# EAGLE design OperantFEDv9 (EAGLE 7.7.0)
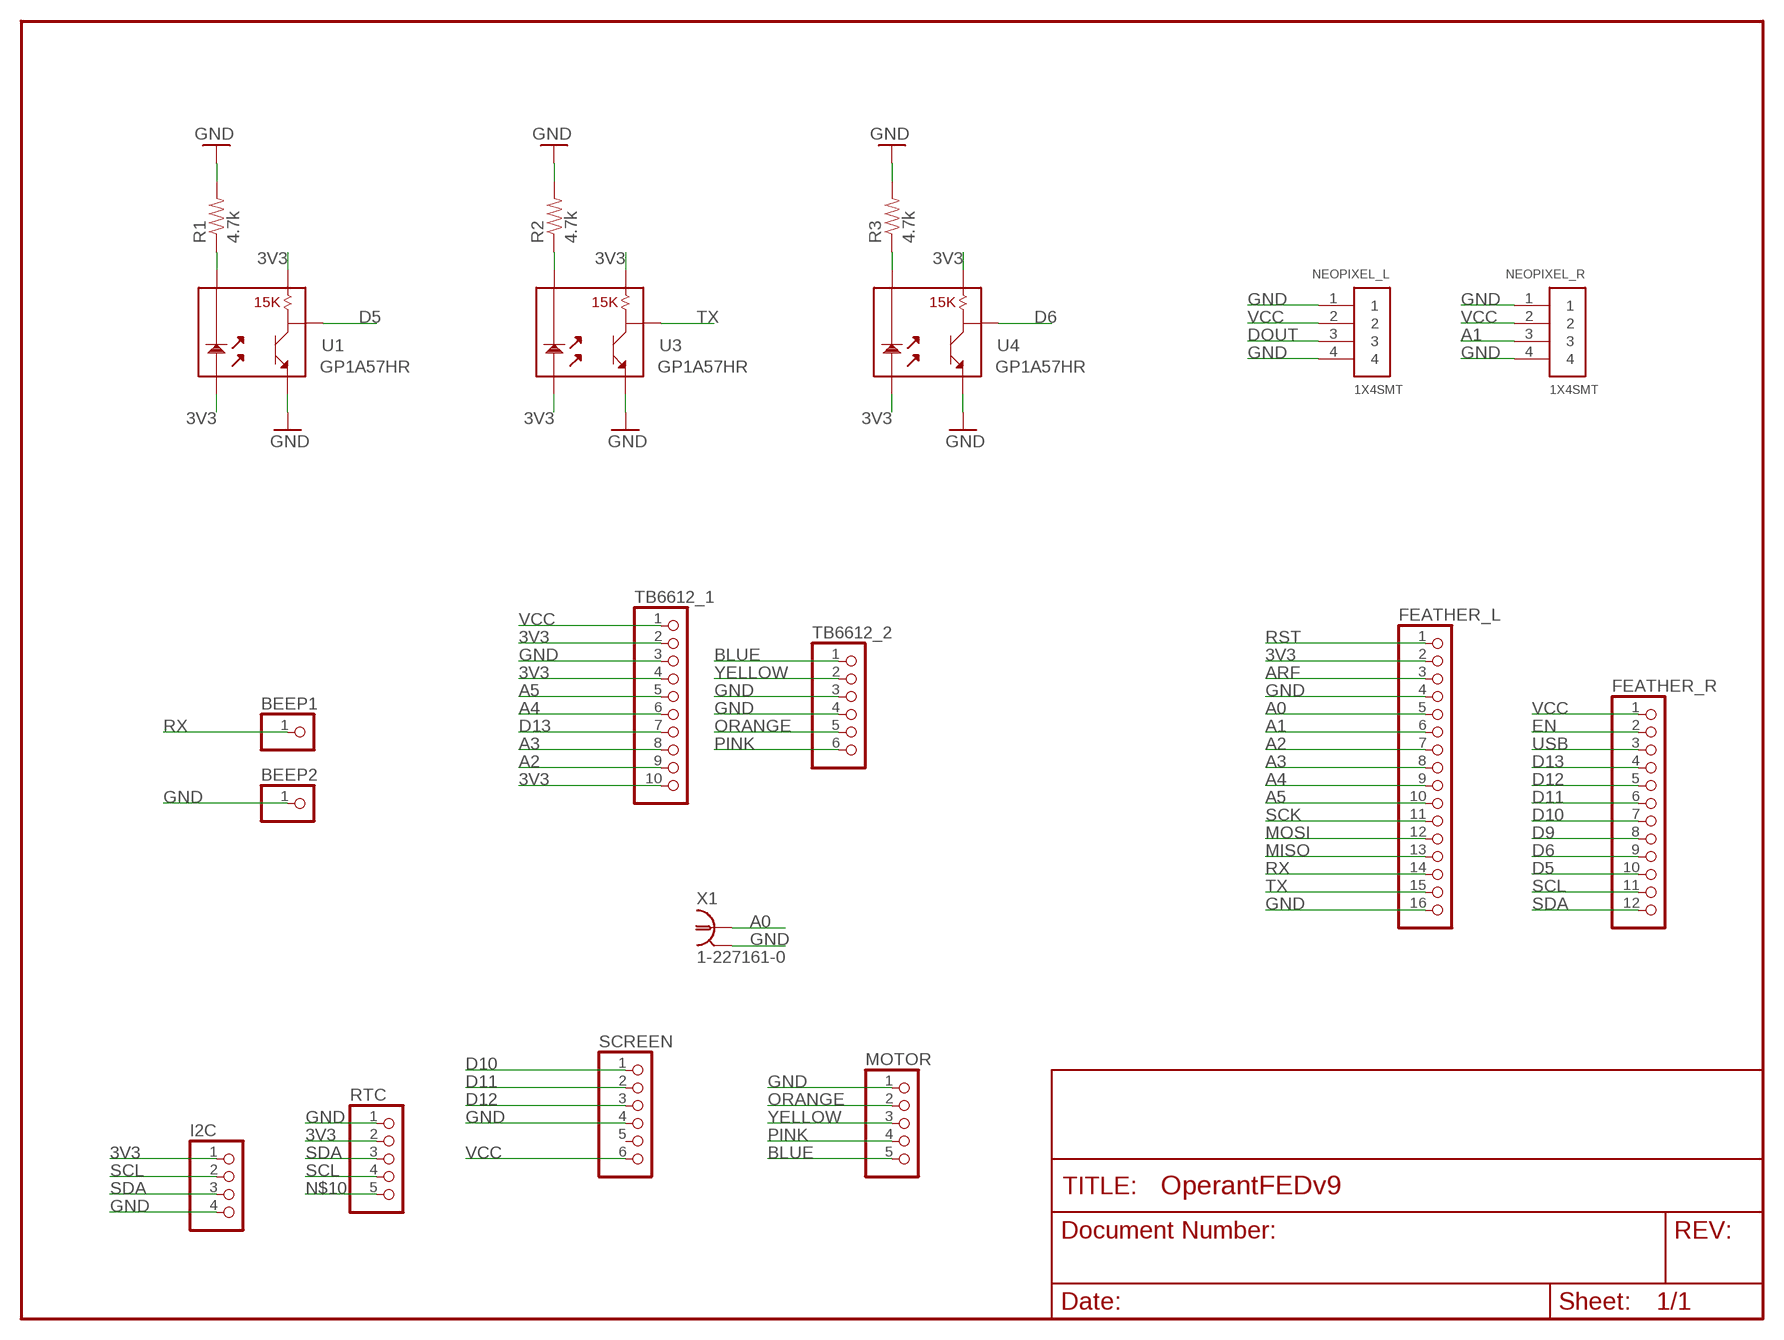
[diagram p0: schematic, sheet 1]

## Parts
BEEP1  PINHD-1X1  [1X01]
BEEP2  PINHD-1X1  [1X01]
FEATHER_L  PINHD-1X16  [1X16]
FEATHER_R  PINHD-1X12  [1X12]
I2C  PINHD-1X4  [1X04]
MOTOR  PINHD-1X5  [1X05]
NEOPIXEL_L  1X4SMT  [1X4-SMT]
NEOPIXEL_R  1X4SMT  [1X4-SMT]
R1  4.7k  RESISTORPTH1  [AXIAL-0.3]
R2  4.7k  RESISTORPTH1  [AXIAL-0.3]
R3  4.7k  RESISTORPTH1  [AXIAL-0.3]
RTC  PINHD-1X5  [1X05]
SCREEN  PINHD-1X6  [1X06]
TB6612_1  PINHD-1X10  [1X10]
TB6612_2  PINHD-1X6  [1X06]
U1  GP1A57HR  [GP1A57HR]
U3  GP1A57HR  [GP1A57HR]
U4  GP1A57HR  [GP1A57HR]
X1  1-227161-0  [AMP_227161]

## Nets
3V3: FEATHER_L.2 I2C.1 RTC.2 TB6612_1.2 TB6612_1.4 TB6612_1.10 U1.1 U1.3 U3.1 U3.3 U4.1 U4.3
A0: FEATHER_L.5 X1.1
A1: FEATHER_L.6 NEOPIXEL_R.3
A2: FEATHER_L.7 TB6612_1.9
A3: FEATHER_L.8 TB6612_1.8
A4: FEATHER_L.9 TB6612_1.6
A5: FEATHER_L.10 TB6612_1.5
ARF: FEATHER_L.3
BLUE: MOTOR.5 TB6612_2.1
D5: FEATHER_R.10 U1.4
D6: FEATHER_R.9 U4.4
D9: FEATHER_R.8
D10: FEATHER_R.7 SCREEN.1
D11: FEATHER_R.6 SCREEN.2
D12: FEATHER_R.5 SCREEN.3
D13: FEATHER_R.4 TB6612_1.7
DOUT: NEOPIXEL_L.3
EN: FEATHER_R.2
GND: BEEP2.1 FEATHER_L.4 FEATHER_L.16 I2C.4 MOTOR.1 NEOPIXEL_L.1 NEOPIXEL_L.4 NEOPIXEL_R.1 NEOPIXEL_R.4 R1.P$2 R2.P$2 R3.P$2 RTC.1 SCREEN.4 TB6612_1.3 TB6612_2.3 TB6612_2.4 U1.5 U3.5 U4.5 X1.2
MISO: FEATHER_L.13
MOSI: FEATHER_L.12
N$1: R2.P$1 U3.2
N$2: R1.P$1 U1.2
N$3: R3.P$1 U4.2
N$10: RTC.5
ORANGE: MOTOR.2 TB6612_2.5
PINK: MOTOR.4 TB6612_2.6
RST: FEATHER_L.1
RX: BEEP1.1 FEATHER_L.14
SCK: FEATHER_L.11
SCL: FEATHER_R.11 I2C.2 RTC.4
SDA: FEATHER_R.12 I2C.3 RTC.3
TX: FEATHER_L.15 U3.4
USB: FEATHER_R.3
VCC: FEATHER_R.1 NEOPIXEL_L.2 NEOPIXEL_R.2 SCREEN.6 TB6612_1.1
YELLOW: MOTOR.3 TB6612_2.2
Unconnected: SCREEN.5

## Library data of the parts
BEEP1 BEEP2 = pinhead:PINHD-1X1: PIN HEADER
FEATHER_L = pinhead:PINHD-1X16: PIN HEADER
FEATHER_R = pinhead:PINHD-1X12: PIN HEADER
I2C = pinhead:PINHD-1X4: PIN HEADER
MOTOR RTC = pinhead:PINHD-1X5: PIN HEADER
NEOPIXEL_L NEOPIXEL_R = adafruit:1X4: 4-pin connector
R1-R3 = SparkFun:RESISTOR: Resistor Basic schematic elements and footprints for 0603, 1206, and PTH 1/10th watt (small) resistors.
SCREEN TB6612_2 = pinhead:PINHD-1X6: PIN HEADER
TB6612_1 = pinhead:PINHD-1X10: PIN HEADER
U1 U3 U4 = SparkFun:GP1A57HR
X1 = con-coax:?227161*: JACK, RIGHT ANGLE, 50 OHM, PCB, BNC Source: amp_227161.pdf; MF: TYCO ELECTRONICS; MPN: 1-227161; OC_FARNELL: unknown; OC_NEWARK: 33B3200

## Board
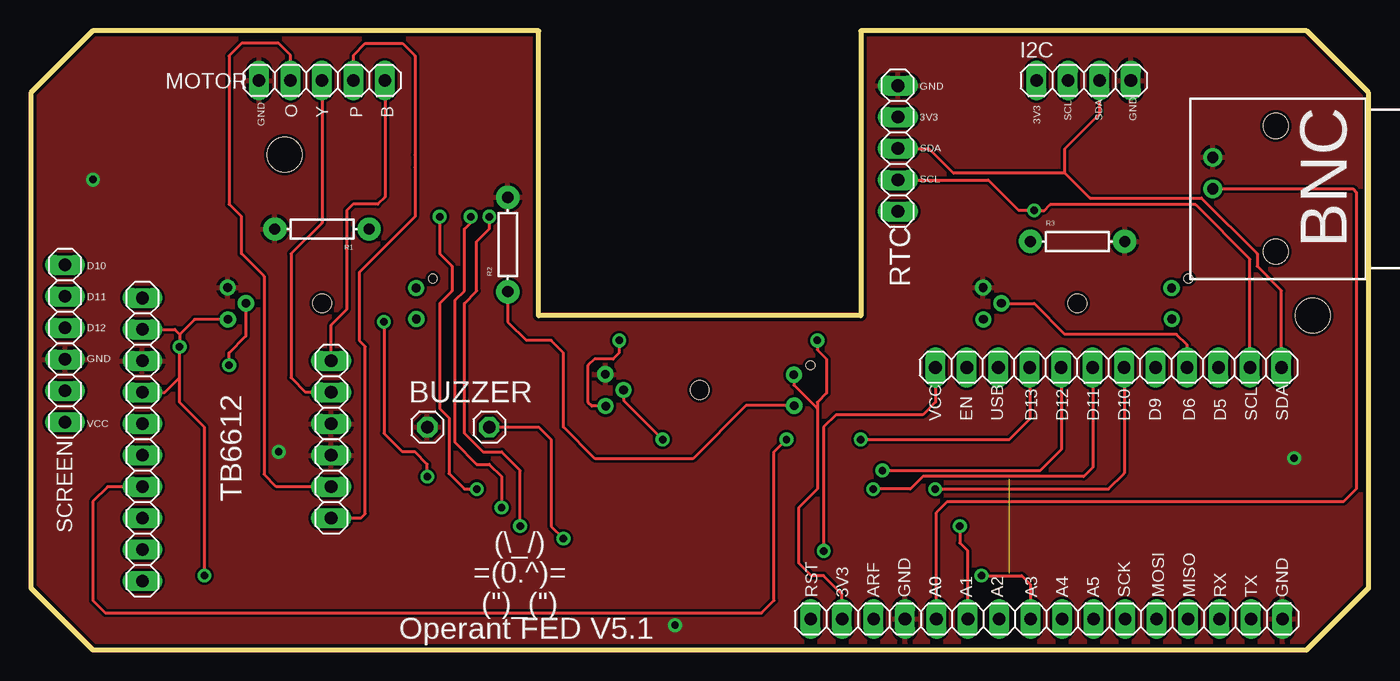
[diagram p1: board, top side]
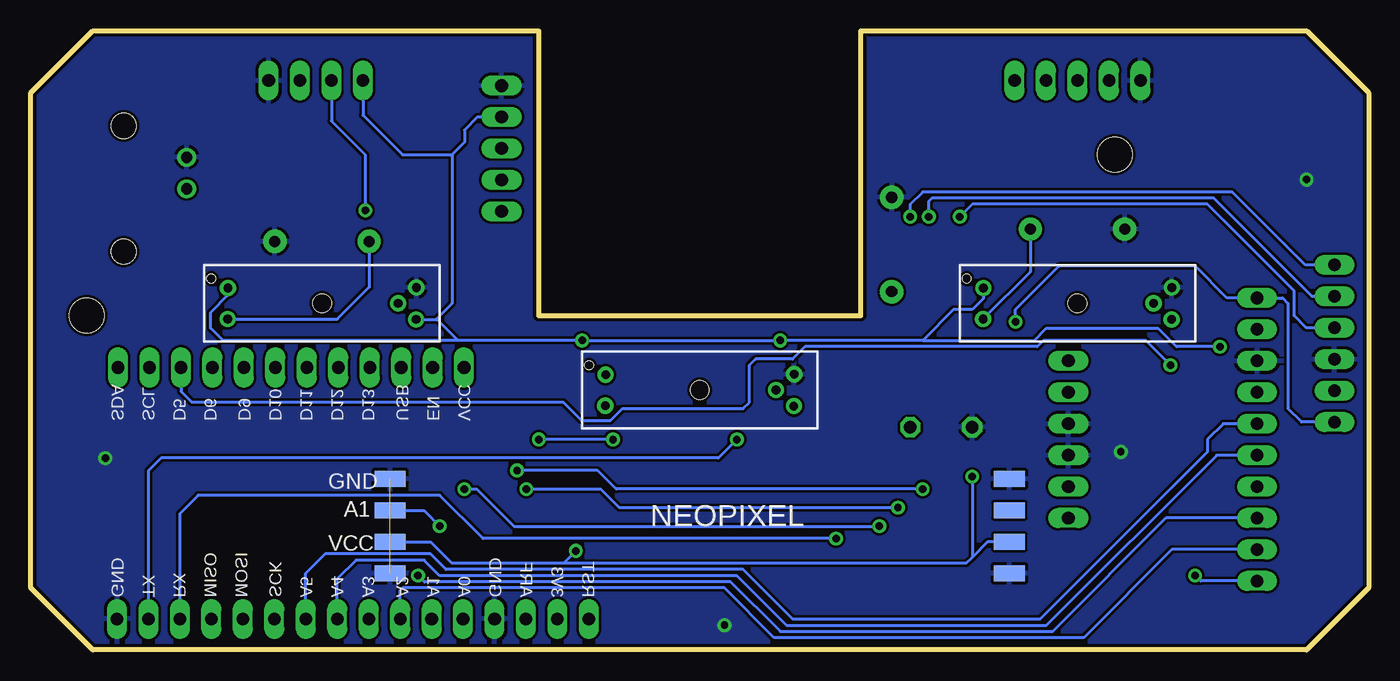
[diagram p2: board, bottom side, seen from below]

Size 108 x 50 mm. Coordinates in mm from the lower left corner, seen from the top.
Outline: 0,45 0,5 5,0 103,0 108,5 108,45 103,50 67,50 67,27 41,27 41,50 5,50 0,45
Copper layers (1*16): Top 0.0356mm / dielectric 1.5011mm / Bottom 0.0356mm
Design rules "default": minimum track width 8mil, minimum drill 20mil, track to track 8mil, track to pad 8mil, pad to pad 8mil, via to via 8mil, smd to smd 8mil, copper to edge 10mil, drill to drill 8mil, minimum pad ring 12mil, minimum via ring 10mil, stop-mask expansion 4mil, vias tented up to drill 20mil, thermal gap 10mil
Holes 2.8 mm at 20.5,40 103.5,27

### Footprints (pad centres in the part's own frame; a part is rotated, then mirrored left to right if it is on the bottom)
1X01 = drill 1.016 octagon: 1 0,0
1X16 = drill 1.016 long: 1 -19.05,0; 2 -16.51,0; 3 -13.97,0; 4 -11.43,0; 5 -8.89,0; 6 -6.35,0; 7 -3.81,0; 8 -1.27,0; 9 1.27,0; 10 3.81,0; 11 6.35,0; 12 8.89,0; 13 11.43,0; 14 13.97,0; 15 16.51,0; 16 19.05,0
1X12 = drill 1.016 long: 1 -13.97,0; 2 -11.43,0; 3 -8.89,0; 4 -6.35,0; 5 -3.81,0; 6 -1.27,0; 7 1.27,0; 8 3.81,0; 9 6.35,0; 10 8.89,0; 11 11.43,0; 12 13.97,0
1X04 = drill 1.016 long: 1 -3.81,0; 2 -1.27,0; 3 1.27,0; 4 3.81,0
1X05 = drill 1.016 long: 1 -5.08,0; 2 -2.54,0; 3 0,0; 4 2.54,0; 5 5.08,0
1X4-SMT = smd 1.27 x 2.54: 1 -3.81,0; 2 -1.27,0; 3 1.27,0; 4 3.81,0
AXIAL-0.3 = drill 0.9 pad 1.88: P$1 -3.81,0; P$2 3.81,0
1X06 = drill 1.016 long: 1 -6.35,0; 2 -3.81,0; 3 -1.27,0; 4 1.27,0; 5 3.81,0; 6 6.35,0
1X10 = drill 1.016 long: 1 -11.43,0; 2 -8.89,0; 3 -6.35,0; 4 -3.81,0; 5 -1.27,0; 6 1.27,0; 7 3.81,0; 8 6.35,0; 9 8.89,0; 10 11.43,0
GP1A57HR = drill 0.7: 1 -7.6,1.24; 2 -7.62,-1.27; 3 7.6,-1.3; 4 6.15,0; 5 7.62,1.27 | hole 1.5: 0,0 | hole 0.7: -8.95,2
AMP_227161 = drill 0.9 pad 1.27: 1 0,-5.08; 2 -2.54,-5.08 | hole 2: -5.08,0; 5.08,0

### Placement (x,y rotation side)
BEEP1  37,18 0 top
BEEP2  32,18 0 top
FEATHER_L  82,2.5 0 top
FEATHER_R  87,22.82 0 top
I2C  85,46 0 top
MOTOR  23.5,46 0 top
NEOPIXEL_L  29,10 90 bottom
NEOPIXEL_R  79,10 90 bottom
R1  23.5,34 180 top
R2  38.5,32.75 90 top
R3  84.5,33 0 top
RTC  70,40.5 270 top
SCREEN  2.75,24.75 270 top
TB6612_1  9,17 270 top
TB6612_2  24.24,17 270 top
U1  23.5,28 0 bottom
U3  54,21 0 bottom
U4  84.5,28 0 bottom
X1  100.5,37.25 270 top

### Tracks (layer width: path | path; a pad name or v marks a point on that pad's centre or on a via)
3V3  (via drill 0.6, 0.6 pad 0.61)
  Top 0.254: 12,22 12,20 14,18 v14,6 | 12,22 v12,24.5 12,25.5 | v47.5,25 47.5,24 47,23.5 45.5,23.5 45,23 45,20 45.3,19.7 U3.3 | 63.5,19.5 63.5,20 64.25,20.75 64.25,23.5 63.5,24.25 v63.5,25 | 63.5,19.5 63.5,13 62,11.5 62,7 63,6 64,6 65.49,4.51 FEATHER_L.2 | TB6612_1.4 10.81,20.81 12,22 | TB6612_1.2 11.61,25.89 12,25.5 | U1.3 13.2,26.7 12,25.5 | U3.1 61.6,21.4 63.5,19.5
  Bottom 0.254: 36,25 v47.5,25 v63.5,25 73.5,25 | 36,25 33.5,27.5 32,27.5 31.1,28.4 U1.1 | U4.1 92.1,28.65 93.5,27.25 93.5,26 92.5,25 73.5,25 | TB6612_1.10 13.57,5.57 v14,6 | v12,24.5 15.5,24.5 17,26 26,26 27,25 36,25 | 74,40 74,28 75.3,26.7 | 75.3,26.7 75.2,26.7 73.5,25 | U4.3 75.3,26.7 | I2C.1 81.19,43.19 78,40 74,40 | 74,40 73,41 73,42 71.96,43.04 RTC.2
A0
  Top 0.254: X1.1 106.75,37.25 107,37 107,13 106,12 74,12 73.11,11.11 FEATHER_L.5
A1  (via drill 0.6)
  Top 0.254: FEATHER_L.6 75.65,8 75,8.65 v75,10
  Bottom 0.254: NEOPIXEL_R.3 76.27,11.27 v75,10
A2
  Bottom 0.254: TB6612_1.9 15.89,8.11 23,1 48,1 52,5 78,5 78.19,4.81 FEATHER_L.7
A3  (via drill 0.6)
  Top 0.254: v76.75,6 80,6 80.73,5.27 FEATHER_L.8
  Bottom 0.254: TB6612_1.8 16.35,10.65 25.5,1.5 47.5,1.5 51.5,5.5 76.25,5.5 v76.75,6
A4
  Bottom 0.254: TB6612_1.6 12.27,15.73 26,2 47,2 51,6 75,6 76.25,7.25 81.75,7.25 83.27,5.73 FEATHER_L.9
A5
  Bottom 0.254: TB6612_1.5 11.73,18.27 13,17 13,16 26.5,2.5 46.5,2.5 50.5,6.5 74.5,6.5 75.75,7.75 84.25,7.75 85.81,6.19 FEATHER_L.10
BLUE
  Top 0.254: MOTOR.5 28.58,36.58 28,36 26,36 25.5,35.5 25.5,27.5 24.24,26.24 TB6612_2.1
D5  (via drill 0.6)
  Top 0.254: v16,23 16,24 17.35,25.35 U1.4
  Bottom 0.254: v16,23 18,25 26.25,25 26.75,24.5 45.5,24.5 46.5,23.5 49.5,23.5 50,23 50,20 50.5,19.5 60.25,19.5 61.25,18.5 63.5,18.5 65,20 95,20 95.89,20.89 FEATHER_R.10
D6
  Top 0.254: U4.4 81,28 83.5,25.5 92.5,25.5 93.35,24.65 FEATHER_R.9
D10  (via drill 0.6)
  Top 0.254: v39.5,10 39.5,14.5 38,16 36.5,16 35,17.5 35,28 36,29 36,33 37,34 v37,35 | v73,13 87,13 88.27,14.27 FEATHER_R.7
  Bottom 0.254: v39.5,10 69,10 72,13 v73,13 | v37,35 37,36 36,37 11,37 5.1,31.1 SCREEN.1
D11  (via drill 0.6)
  Top 0.254: v68,13 71,13 72,14 85,14 85.73,14.73 FEATHER_R.6 | v38,11.5 38,14 37,15 36,15 34.25,16.75 34.25,28.25 35,29 35,34 35.5,34.5 v35.5,35
  Bottom 0.254: v68,13 62,13 60.5,11.5 v38,11.5 | v35.5,35 35.5,36.25 35.25,36.5 12.5,36.5 4.56,28.56 SCREEN.2
D12  (via drill 0.6)
  Top 0.254: v36,13 35,13 33.75,14.25 33.75,18.75 33,19.5 33,28 34,29 34,31 33,32 v33,35 | FEATHER_R.5 83.19,16.19 81.5,14.5 v68.75,14.5
  Bottom 0.254: v36,13 60.75,13 62.25,14.5 v68.75,14.5 | SCREEN.3 5.02,26.02 6,27 6,29 13,36 32,36 v33,35
D13  (via drill 0.6)
  Top 0.254: FEATHER_R.4 80.65,18.65 79,17 v67,17 | TB6612_1.7 6.19,13.19 5,12 5,4 6,3 59,3 60,4 60,16 v61,17
  Bottom 0.254: v61,17 v67,17
GND  (via drill 0.6 pad 0.81)  (1 unrouted)
  other vias: 102,15.5 52,2 20,16 5,38
  pour Bottom: 0,5 5,0 103,0 108,5 108,45 103,50 67,50 67,27 41,27 41,50 5,50 0,45
  pour Top: 0,5 5,0 103,0 108,5 108,45 103,50 67,50 67,27 41,27 41,50 5,50 0,45
N$1
  Top 0.254: U3.2 57.73,19.73 53.44,15.44 45.56,15.44 43,18 43,24 42,25 40,25 38.5,26.5 R2.P$1
N$2
  Bottom 0.254: R1.P$1 27.31,30.54 U1.2
N$3
  Bottom 0.254: U4.2 83.27,26.73 80.69,29.31 R3.P$1
ORANGE
  Top 0.254: TB6612_2.5 19.81,13.19 18.81,14.19 18.81,30.19 17,32 17,35 16,36 16,48 17,49 20,49 20.96,48.04 MOTOR.2
PINK
  Top 0.254: TB6612_2.6 26.65,10.65 27,11 27,24.5 26.5,25 26.5,30.5 31,35 31,39 31,40 31,48 30,49 27,49 26.04,48.04 MOTOR.4
RX  (via drill 0.6)
  Top 0.254: BEEP1.1 41,18 42,17 42,10 v43,9
  Bottom 0.254: v43,9 71.5,9 75,12.5 94.5,12.5 95.97,11.03 FEATHER_L.14
SCL  (via drill 0.6)
  Top 0.254: FEATHER_R.11 98.43,31.57 94.04,35.96 82.29,35.96 81.83,35.5 v81,35.5 79.75,35.5 77.29,37.96 RTC.4
  Bottom 0.254: I2C.2 83.73,42.73 81,40 v81,35.5
SDA
  Top 0.254: 83.5,38.5 83.5,40.5 86.27,43.27 I2C.3 | FEATHER_R.12 100.97,29.03 99,31 99,32 94.5,36.5 85.5,36.5 83.5,38.5 | 83.5,38.5 74.5,38.5 73.5,39.5 73,40 72.5,40.5 RTC.3
TX  (via drill 0.6)
  Top 0.254: U3.4 47.85,20.15 v51,17
  Bottom 0.254: v51,17 52.5,15.5 97.5,15.5 98.51,14.49 FEATHER_L.15
VCC  (via drill 0.6)
  Top 0.254: v28.5,26.5 28.5,17.5 30,16 31,16 32,15 v32,14 | v64,8 64,9 64,10 64,18 65,19 72,19 73.03,20.03 FEATHER_R.1
  Bottom 0.254: 65,7 32.5,7 32,7.5 | 65,7 74,7 75.73,8.73 NEOPIXEL_R.2 | 32,7.5 30.77,8.73 NEOPIXEL_L.2 | v28.5,26.5 28.5,27.5 25,31 14,31 11.43,28.43 TB6612_1.1 6.93,28.43 6.5,28 6.5,19.5 5.4,18.4 SCREEN.6 | v32,14 32,7.5 | v64,8 65,7
YELLOW
  Top 0.254: MOTOR.3 23.5,34.5 21,32 21,22 22.19,20.81 TB6612_2.2

### Text on the board
tNames: GND | GND | O | Y | P | B | 3V3 | SCL | SDA | GND | 3V3 | SDA | SCL | BNC | D10 | D11 | D12 | GND | BUZZER | VCC | VCC | EN | USB | D13 | D12 | D11 | D10 | D9 | D6 | D5 | SCL | SDA | TB6612 | (\\_/) / =(0.^)= / (")_(") | RST | 3V3 | ARF | GND | A0 | A0 | A1 | A2 | A3 | A4 | A5 | SCK | MOSI | MISO | RX | TX | GND | Operant FED V5.1
bNames: VCC | EN | USB | D13 | D12 | D11 | D10 | D9 | D6 | D5 | SCL | SDA | GND | A1 | NEOPIXEL | VCC | RST | 3V3 | ARF | GND | A0 | A1 | A2 | A3 | A4 | A5 | SCK | MOSI | MISO | RX | TX | GND